# Altium schematic sheet Regulators_References.SchDoc
size A; SheetNumber: 5; SheetTotal: 6
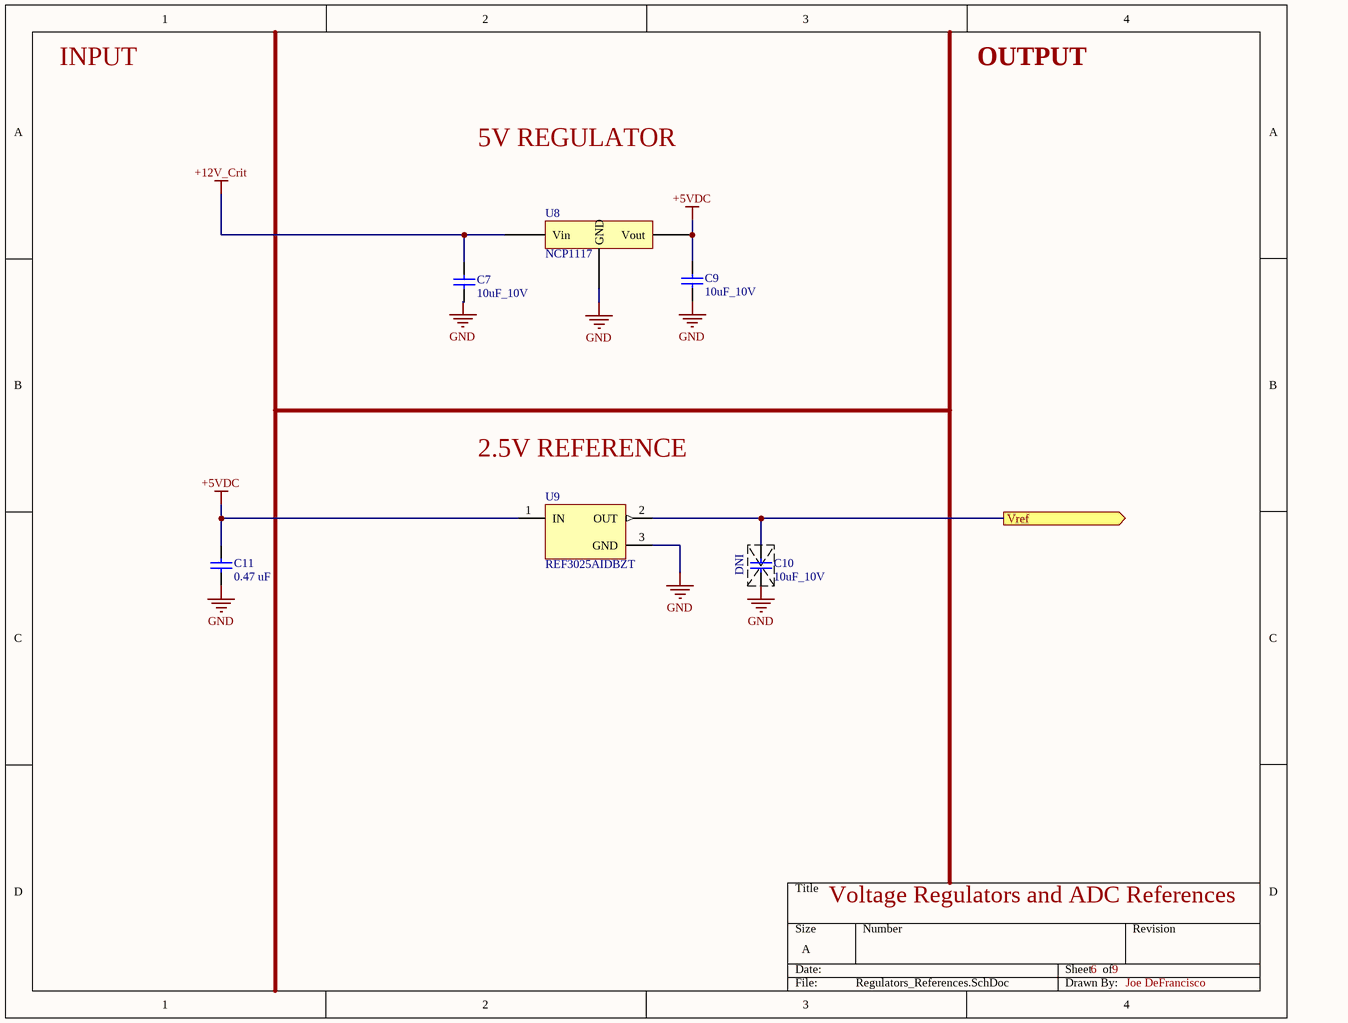
[diagram p0: Regulators_References.SchDoc]

## Parts
C7  SchematicInformation: 10uF_10V  [C_0603]  (hidden comment: Cap_10uF_10V_0603)
C9  SchematicInformation: 10uF_10V  [C_0603]  (hidden comment: Cap_10uF_10V_0603)
C10  SchematicInformation: 10uF_10V  [C_0603]  (hidden comment: Cap_10uF_10V_0603)
C11  value 0.47 uF  [C_0603]  (hidden comment: Capacitor - Ceramic)
DNI?  DO NOT INSTALL  (value not drawn)  (graphical)
U8  NCP1117  [NCP1117-DPAK]
U9  REF3025AIDBZT  [DBZ0003A_N]

## Ports
Vref (out)

## Nets
+5VDC: C9.2 C11.2 U8.2(Vout) U9.1(IN)
+12V_Crit: C7.2 U8.3(Vin)
GND: C7.1 C9.1 C10.1 C11.1 U8.1(GND) U9.3(GND)
Vref: C10.2 U9.2(OUT) ; port Vref

## Notes on the sheet
- INPUT
- OUTPUT
- 5V REGULATOR
- 2.5V REFERENCE
- Voltage Regulators and ADC References
- 6
- 9
- Joe DeFrancisco

## Library data of the parts
C7 C9 C10 = Cap_10uF_10V_0603: Manufacturer Part Number: GRM188R61A106ME69D; Manufacturer: Murata Electronics; Dielectric: X5R
DNI? = DNI
U9 = CMP-0367-00150-2: 2.5 V, 50 ppm / degC, 50 uA Series (Bandgap) Voltage Reference, -40 to 125 degC, 3-pin SOT-23 (DBZ), Green (RoHS & no Sb/Br); Manufacturer: Texas Instruments; VI(Min)(V): 2.501; Initial Accuracy @ 25/deg C(%): 0.2; Rating: Catalog; VO(V): 2.5; Iq(Max)(uA): 50; Temp Coeff(Typ)(ppm/ degree C): 20; SubFamily: Series Voltage Reference; VI(Max)(V): 5.5; ComponentLink4Description: URL Link1; PartNumber: REF3025AIDBZT; ComponentLink1URL: http://www.ti.com/; Eco-Plan: Green (RoHS & no Sb/Br); ComponentLink3URL: http://www.ti.com/litv/pdf/mpds108a; Mounting Technology: Surface Mount; ComponentLink3Description: Package Specification; PackageDescription: 3-Pin Plastic Small Outline, Body 2.92 x 1.3 mm, Pitch 0.95 mm; PackageReference: DBZ0003A; Code_JEDEC: TO-236; Temp Coeff(Max)(ppm/ degree C): 50; ComponentLink4URL: Samples URL:http://www.ti.com/product/ref3025; ComponentLink2Description: Datasheet; ComponentLink2URL: http://www.ti.com/general/docs/lit/getliterature.tsp?genericPartNumber=REF3025&fileType=pdf; PackageVersion: 4203227/B; ComponentLink1Description: Manufacturer URL; DatasheetVersion: SBVS032F
C11 = Capacitor - Ceramic: Digikey: ?; Datasheet: ?
U8 = NCP1117: ComponentLink1Description: Digikey; ComponentLink1URL: https://www.digikey.com/product-detail/en/on-semiconductor/NCP1117DT33T5G/NCP1117DT33T5GOSCT-ND/2121236